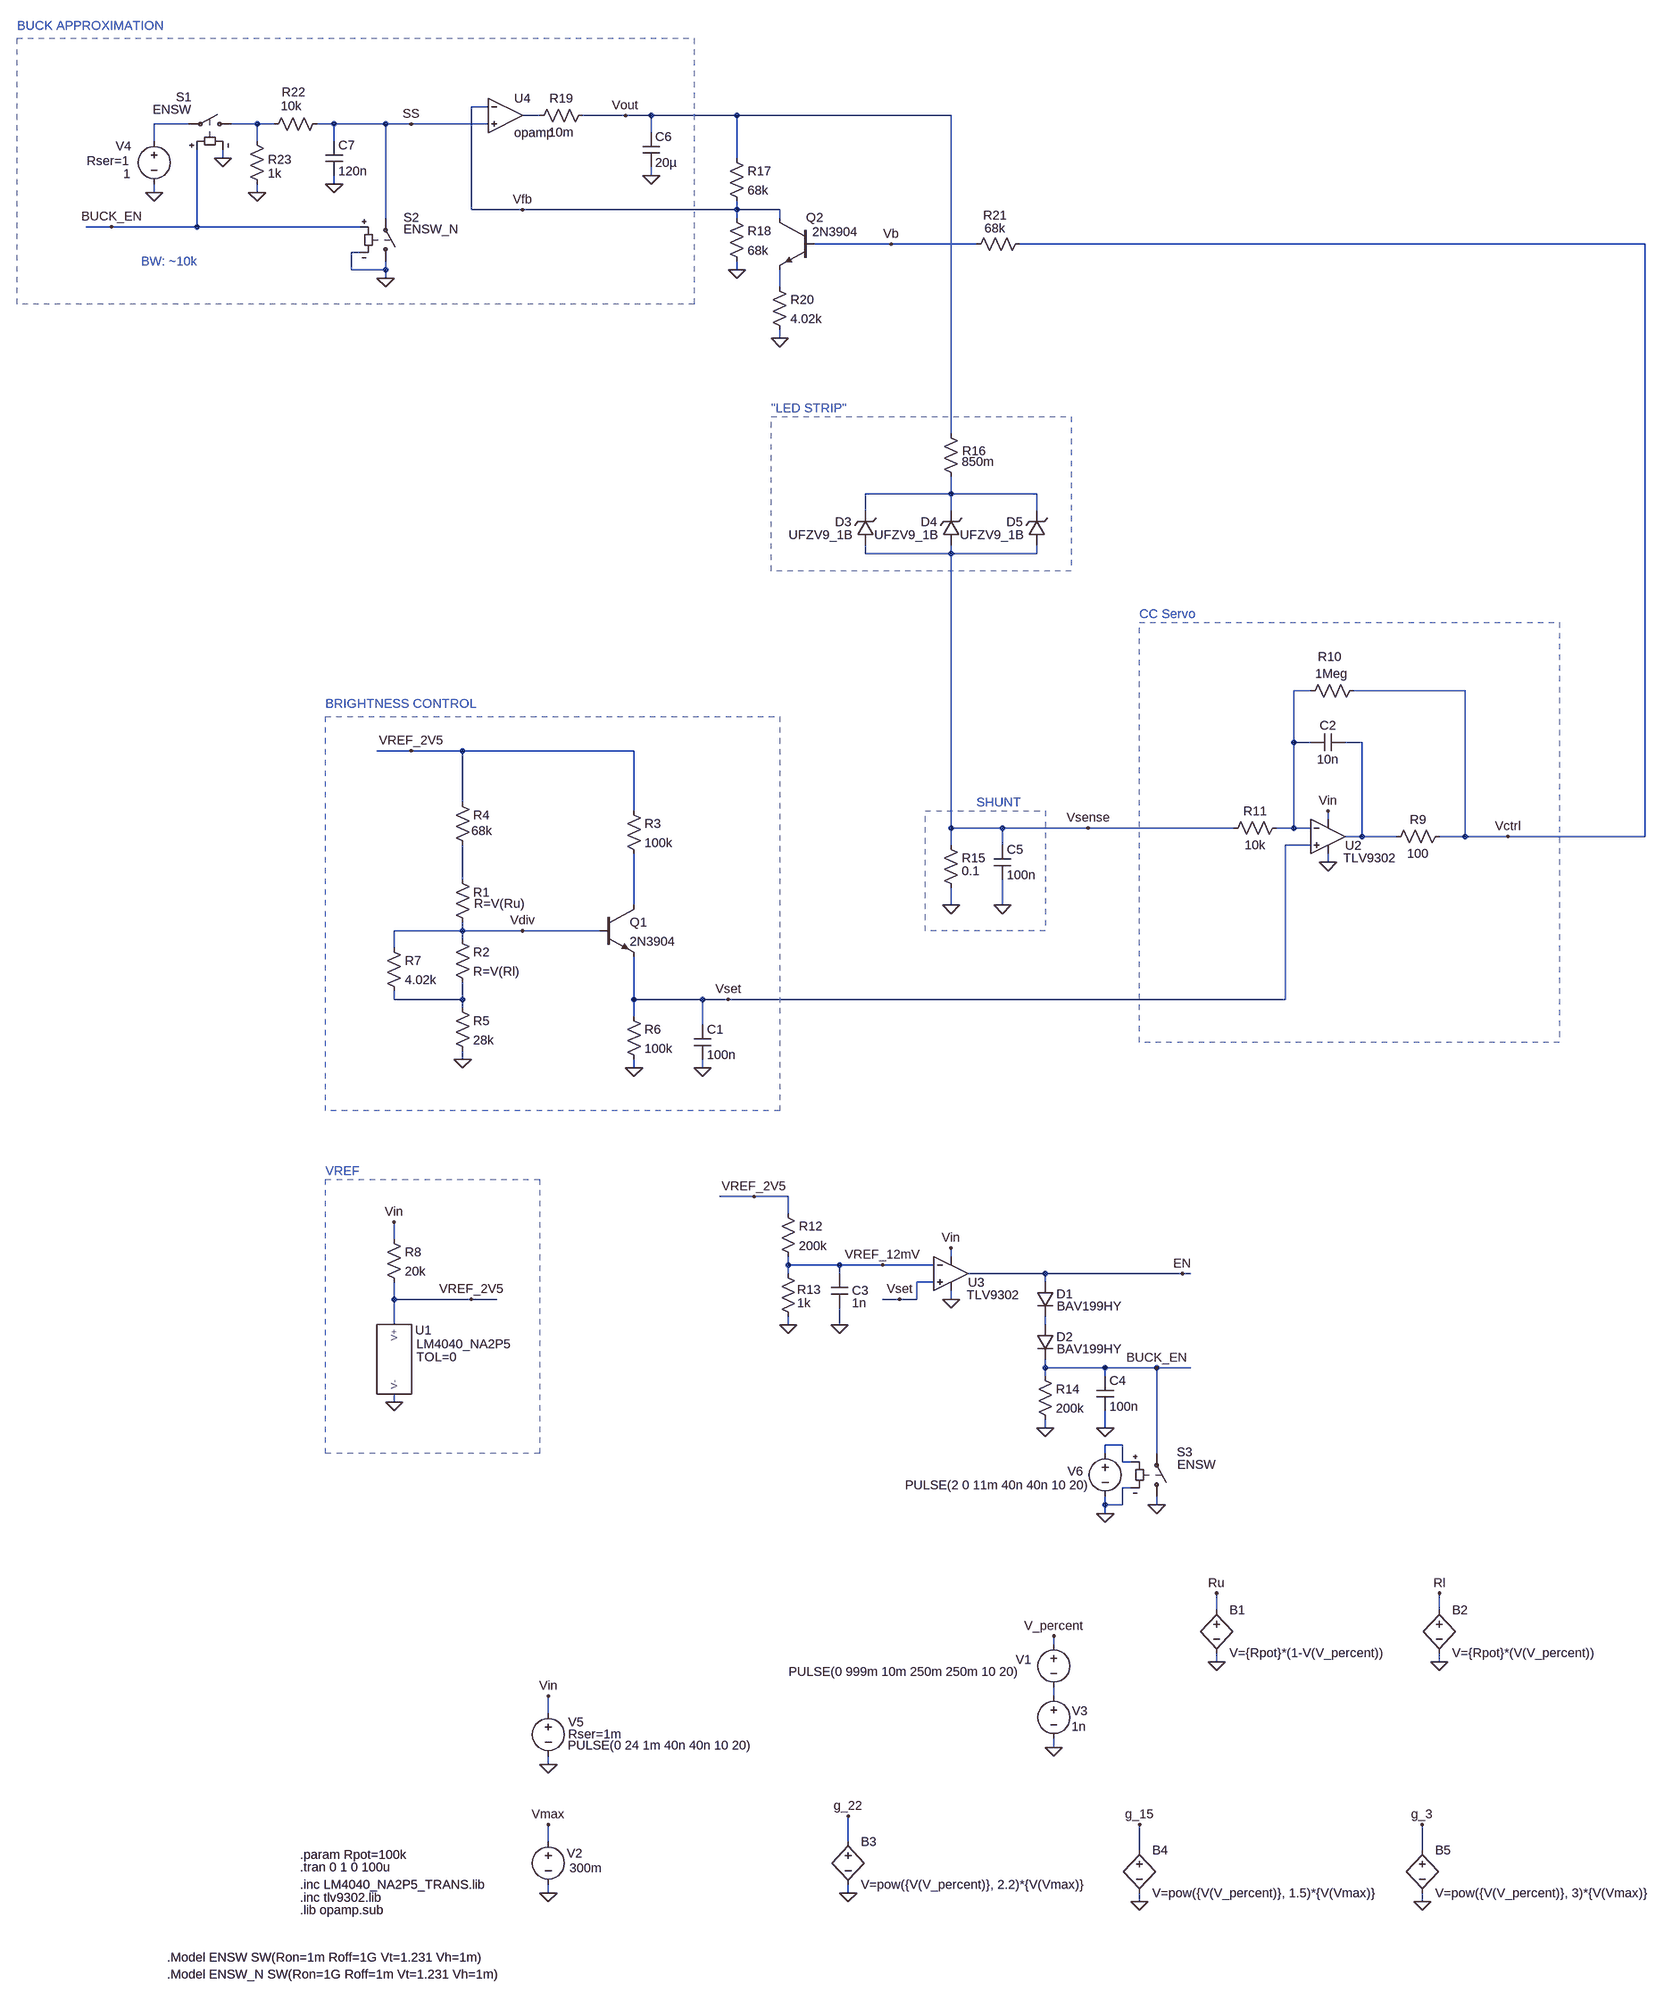
[diagram p0: schematic en2.asc]
en2.asc, the LTspice schematic file:
Version 4
SHEET 1 1748 1752
WIRE -1120 -2416 -1152 -2416
WIRE -1024 -2400 -1056 -2400
WIRE -864 -2400 -944 -2400
WIRE -816 -2400 -864 -2400
WIRE -656 -2400 -816 -2400
WIRE -256 -2400 -656 -2400
WIRE -1680 -2384 -1744 -2384
WIRE -1552 -2384 -1600 -2384
WIRE -1520 -2384 -1552 -2384
WIRE -1408 -2384 -1440 -2384
WIRE -1312 -2384 -1408 -2384
WIRE -1264 -2384 -1312 -2384
WIRE -1120 -2384 -1264 -2384
WIRE -816 -2368 -816 -2400
WIRE -1744 -2352 -1744 -2384
WIRE -1552 -2352 -1552 -2384
WIRE -1408 -2352 -1408 -2384
WIRE -1616 -2320 -1616 -2336
WIRE -656 -2320 -656 -2400
WIRE -816 -2288 -816 -2304
WIRE -1408 -2272 -1408 -2288
WIRE -1744 -2256 -1744 -2272
WIRE -1552 -2256 -1552 -2272
WIRE -1152 -2224 -1152 -2416
WIRE -1056 -2224 -1152 -2224
WIRE -656 -2224 -656 -2240
WIRE -656 -2224 -1056 -2224
WIRE -576 -2224 -656 -2224
WIRE -1312 -2208 -1312 -2384
WIRE -656 -2208 -656 -2224
WIRE -576 -2208 -576 -2224
WIRE -1824 -2192 -1872 -2192
WIRE -1664 -2192 -1664 -2336
WIRE -1664 -2192 -1824 -2192
WIRE -1360 -2192 -1664 -2192
WIRE -368 -2160 -512 -2160
WIRE -208 -2160 -368 -2160
WIRE 1040 -2160 -128 -2160
WIRE -1360 -2144 -1376 -2144
WIRE -1376 -2112 -1376 -2144
WIRE -1312 -2112 -1312 -2128
WIRE -1312 -2112 -1376 -2112
WIRE -656 -2112 -656 -2128
WIRE -1312 -2096 -1312 -2112
WIRE -576 -2080 -576 -2112
WIRE -576 -1984 -576 -2000
WIRE -256 -1504 -256 -2400
WIRE -256 -1392 -256 -1424
WIRE -256 -1392 -416 -1392
WIRE -96 -1392 -256 -1392
WIRE -416 -1360 -416 -1392
WIRE -256 -1360 -256 -1392
WIRE -96 -1360 -96 -1392
WIRE -416 -1280 -416 -1296
WIRE -256 -1280 -256 -1296
WIRE -256 -1280 -416 -1280
WIRE -96 -1280 -96 -1296
WIRE -96 -1280 -256 -1280
WIRE 416 -1024 384 -1024
WIRE 704 -1024 496 -1024
WIRE 384 -928 384 -1024
WIRE 416 -928 384 -928
WIRE 512 -928 480 -928
WIRE -1264 -912 -1328 -912
WIRE -1168 -912 -1264 -912
WIRE -848 -912 -1168 -912
WIRE -1168 -816 -1168 -912
WIRE -848 -800 -848 -912
WIRE 448 -784 448 -800
WIRE -256 -768 -256 -1280
WIRE -160 -768 -256 -768
WIRE 0 -768 -160 -768
WIRE 272 -768 0 -768
WIRE 384 -768 384 -928
WIRE 384 -768 352 -768
WIRE 416 -768 384 -768
WIRE 512 -752 512 -928
WIRE 512 -752 480 -752
WIRE 576 -752 512 -752
WIRE 704 -752 704 -1024
WIRE 704 -752 656 -752
WIRE 784 -752 704 -752
WIRE 1040 -752 1040 -2160
WIRE 1040 -752 784 -752
WIRE -256 -736 -256 -768
WIRE -160 -736 -160 -768
WIRE 416 -736 368 -736
WIRE 448 -704 448 -720
WIRE -1168 -672 -1168 -736
WIRE -848 -624 -848 -720
WIRE -256 -624 -256 -656
WIRE -160 -624 -160 -672
WIRE -1168 -576 -1168 -592
WIRE -1168 -576 -1296 -576
WIRE -1056 -576 -1168 -576
WIRE -912 -576 -1056 -576
WIRE -1168 -560 -1168 -576
WIRE -1296 -544 -1296 -576
WIRE -1296 -448 -1296 -464
WIRE -1168 -448 -1168 -480
WIRE -1168 -448 -1296 -448
WIRE -848 -448 -848 -528
WIRE -720 -448 -848 -448
WIRE -672 -448 -720 -448
WIRE 368 -448 368 -736
WIRE 368 -448 -672 -448
WIRE -1168 -432 -1168 -448
WIRE -848 -416 -848 -448
WIRE -720 -400 -720 -448
WIRE -1168 -336 -1168 -352
WIRE -848 -320 -848 -336
WIRE -720 -320 -720 -336
WIRE -624 160 -688 160
WIRE -560 160 -624 160
WIRE -560 192 -560 160
WIRE -1296 240 -1296 208
WIRE -256 272 -256 256
WIRE -560 288 -560 272
WIRE -464 288 -560 288
WIRE -384 288 -464 288
WIRE -288 288 -384 288
WIRE -560 304 -560 288
WIRE -464 304 -464 288
WIRE -80 304 -224 304
WIRE 176 304 -80 304
WIRE 192 304 176 304
WIRE -288 320 -320 320
WIRE -80 320 -80 304
WIRE -1296 352 -1296 320
WIRE -1152 352 -1296 352
WIRE -1104 352 -1152 352
WIRE -352 352 -384 352
WIRE -320 352 -320 320
WIRE -320 352 -352 352
WIRE -256 352 -256 336
WIRE -1296 400 -1296 352
WIRE -560 400 -560 384
WIRE -464 400 -464 368
WIRE -80 400 -80 384
WIRE -80 480 -80 464
WIRE 32 480 -80 480
WIRE 128 480 32 480
WIRE 192 480 128 480
WIRE -80 496 -80 480
WIRE 32 496 32 480
WIRE -1296 544 -1296 528
WIRE -80 592 -80 576
WIRE 32 592 32 560
WIRE 64 624 32 624
WIRE 32 640 32 624
WIRE 128 640 128 480
WIRE 64 656 64 624
WIRE 80 656 64 656
WIRE 80 704 64 704
WIRE 32 736 32 720
WIRE 64 736 64 704
WIRE 64 736 32 736
WIRE 128 736 128 720
WIRE 32 752 32 736
WIRE 240 1056 240 1024
WIRE 656 1056 656 1024
WIRE -64 1120 -64 1104
WIRE 240 1152 240 1136
WIRE 656 1152 656 1136
WIRE -64 1216 -64 1200
WIRE -1008 1248 -1008 1216
WIRE -64 1312 -64 1296
WIRE -1008 1344 -1008 1328
WIRE -1008 1488 -1008 1456
WIRE -448 1488 -448 1440
WIRE 96 1504 96 1456
WIRE 624 1504 624 1456
WIRE -1008 1584 -1008 1568
WIRE -448 1584 -448 1568
WIRE 96 1600 96 1584
WIRE 624 1600 624 1584
FLAG -64 1312 0
FLAG -64 1104 V_percent
FLAG 240 1152 0
FLAG 240 1024 Ru
FLAG 656 1152 0
FLAG 656 1024 Rl
FLAG -448 1584 0
FLAG -448 1440 g_22
FLAG 96 1600 0
FLAG 96 1456 g_15
FLAG 624 1600 0
FLAG 624 1456 g_3
FLAG -1008 1456 Vmax
FLAG -1008 1584 0
FLAG -1168 -336 0
FLAG -672 -448 Vset
FLAG -848 -320 0
FLAG -1056 -576 Vdiv
FLAG -1296 544 0
FLAG -1008 1344 0
FLAG -1008 1216 Vin
FLAG -1152 352 VREF_2V5
FLAG -1296 208 Vin
FLAG -720 -320 0
FLAG -1264 -912 VREF_2V5
FLAG 784 -752 Vctrl
FLAG 448 -704 0
FLAG 448 -800 Vin
FLAG -256 352 0
FLAG -256 256 Vin
FLAG -560 400 0
FLAG -464 400 0
FLAG -624 160 VREF_2V5
FLAG -352 352 Vset
FLAG -384 288 VREF_12mV
FLAG 176 304 EN
FLAG -80 592 0
FLAG 32 592 0
FLAG 128 480 BUCK_EN
FLAG -256 -624 0
FLAG -160 -624 0
FLAG 0 -768 Vsense
FLAG -1744 -2256 0
FLAG -656 -2112 0
FLAG -816 -2288 0
FLAG -864 -2400 Vout
FLAG -1056 -2224 Vfb
FLAG -576 -1984 0
FLAG -368 -2160 Vb
FLAG -1552 -2256 0
FLAG -1616 -2320 0
FLAG -1408 -2272 0
FLAG -1312 -2096 0
FLAG -1824 -2192 BUCK_EN
FLAG -1264 -2384 SS
FLAG 128 736 0
FLAG 32 752 0
SYMBOL voltage -64 1104 R0
WINDOW 0 -71 44 Left 2
WINDOW 3 -495 67 Left 2
WINDOW 123 0 0 Left 0
WINDOW 39 0 0 Left 0
SYMATTR InstName V1
SYMATTR Value PULSE(0 999m 10m 250m 250m 10 20)
SYMBOL res -1184 -688 R0
WINDOW 3 37 61 Left 2
SYMATTR Value R=V(Ru)
SYMATTR InstName R1
SYMBOL res -1184 -576 R0
SYMATTR InstName R2
SYMATTR Value R=V(Rl)
SYMBOL bv 240 1040 R0
SYMATTR InstName B1
SYMATTR Value V={Rpot}*(1-V(V_percent))
SYMBOL bv 656 1040 R0
SYMATTR InstName B2
SYMATTR Value V={Rpot}*(V(V_percent))
SYMBOL voltage -64 1200 R0
WINDOW 0 34 44 Left 2
WINDOW 3 33 73 Left 2
WINDOW 123 0 0 Left 0
WINDOW 39 0 0 Left 0
SYMATTR InstName V3
SYMATTR Value 1n
SYMBOL bv -448 1472 R0
SYMATTR InstName B3
SYMATTR Value V=pow({V(V_percent)}, 2.2)*{V(Vmax)}
SYMBOL bv 96 1488 R0
SYMATTR InstName B4
SYMATTR Value V=pow({V(V_percent)}, 1.5)*{V(Vmax)}
SYMBOL bv 624 1488 R0
SYMATTR InstName B5
SYMATTR Value V=pow({V(V_percent)}, 3)*{V(Vmax)}
SYMBOL res -1184 -832 R0
WINDOW 3 32 69 Left 2
SYMATTR Value 68k
SYMATTR InstName R4
SYMBOL voltage -1008 1472 R0
WINDOW 0 35 38 Left 2
WINDOW 3 40 65 Left 2
WINDOW 123 0 0 Left 0
WINDOW 39 0 0 Left 0
SYMATTR InstName V2
SYMATTR Value 300m
SYMBOL npn -912 -624 R0
SYMATTR InstName Q1
SYMATTR Value 2N3904
SYMBOL res -1184 -448 R0
SYMATTR InstName R5
SYMATTR Value 28k
SYMBOL res -864 -816 R0
SYMATTR InstName R3
SYMATTR Value 100k
SYMBOL res -864 -432 R0
SYMATTR InstName R6
SYMATTR Value 100k
SYMBOL res -1312 -560 R0
SYMATTR InstName R7
SYMATTR Value 4.02k
SYMBOL voltage -1008 1232 R0
WINDOW 0 37 33 Left 2
WINDOW 3 36 76 Left 2
WINDOW 123 0 0 Left 0
WINDOW 39 37 55 Left 2
SYMATTR InstName V5
SYMATTR Value PULSE(0 24 1m 40n 40n 10 20)
SYMATTR SpiceLine Rser=1m
SYMBOL res -1312 224 R0
SYMATTR InstName R8
SYMATTR Value 20k
SYMBOL LM4040_NA2P5 -1296 464 R0
WINDOW 0 55 -39 Bottom 2
SYMATTR InstName U1
SYMBOL cap -736 -400 R0
SYMATTR InstName C1
SYMATTR Value 100n
SYMBOL OpAmps\\opamp2 448 -816 R0
WINDOW 0 32 81 Left 2
WINDOW 3 29 104 Left 2
SYMATTR InstName U2
SYMATTR Value TLV9302
SYMBOL cap 480 -944 R90
WINDOW 0 0 32 VBottom 2
WINDOW 3 32 32 VTop 2
SYMATTR InstName C2
SYMATTR Value 10n
SYMBOL res 672 -768 R90
WINDOW 0 0 56 VBottom 2
WINDOW 3 32 56 VTop 2
SYMATTR InstName R9
SYMATTR Value 100
SYMBOL res 512 -1040 R90
WINDOW 0 -32 61 VBottom 2
WINDOW 3 -32 57 VTop 2
SYMATTR InstName R10
SYMATTR Value 1Meg
SYMBOL res 368 -784 R90
WINDOW 0 0 56 VBottom 2
WINDOW 3 32 56 VTop 2
SYMATTR InstName R11
SYMATTR Value 10k
SYMBOL OpAmps\\opamp2 -256 240 R0
WINDOW 0 32 81 Left 2
WINDOW 3 29 104 Left 2
SYMATTR InstName U3
SYMATTR Value TLV9302
SYMBOL res -576 176 R0
SYMATTR InstName R12
SYMATTR Value 200k
SYMBOL res -576 288 R0
WINDOW 0 33 46 Left 2
WINDOW 3 33 71 Left 2
SYMATTR InstName R13
SYMATTR Value 1k
SYMBOL cap -480 304 R0
WINDOW 0 39 32 Left 2
WINDOW 3 39 55 Left 2
SYMATTR InstName C3
SYMATTR Value 1n
SYMBOL diode -96 320 R0
WINDOW 0 37 22 Left 2
WINDOW 3 38 45 Left 2
SYMATTR InstName D1
SYMATTR Value BAV199HY
SYMBOL diode -96 400 R0
WINDOW 0 37 22 Left 2
WINDOW 3 38 45 Left 2
SYMATTR InstName D2
SYMATTR Value BAV199HY
SYMBOL res -96 480 R0
SYMATTR InstName R14
SYMATTR Value 200k
SYMBOL cap 16 496 R0
SYMATTR InstName C4
SYMATTR Value 100n
SYMBOL res -272 -752 R0
WINDOW 3 36 64 Left 2
SYMATTR Value 0.1
SYMATTR InstName R15
SYMBOL cap -176 -736 R0
SYMATTR InstName C5
SYMATTR Value 100n
SYMBOL zener -400 -1296 R180
WINDOW 0 42 43 Left 2
WINDOW 3 40 19 Left 2
SYMATTR InstName D3
SYMATTR Value UFZV9_1B
SYMATTR Description Diode
SYMATTR Type diode
SYMBOL res -272 -1520 R0
WINDOW 0 37 48 Left 2
WINDOW 3 36 68 Left 2
SYMATTR InstName R16
SYMATTR Value 850m
SYMBOL voltage -1744 -2368 R0
WINDOW 0 -72 25 Left 2
WINDOW 3 -58 77 Left 2
WINDOW 123 0 0 Left 0
WINDOW 39 -126 53 Left 2
SYMATTR InstName V4
SYMATTR Value 1
SYMATTR SpiceLine Rser=1
SYMBOL res -672 -2336 R0
SYMATTR InstName R17
SYMATTR Value 68k
SYMBOL res -672 -2224 R0
SYMATTR InstName R18
SYMATTR Value 68k
SYMBOL res -928 -2416 R90
WINDOW 0 0 56 VBottom 2
WINDOW 3 32 56 VTop 2
SYMATTR InstName R19
SYMATTR Value 10m
SYMBOL cap -832 -2368 R0
SYMATTR InstName C6
SYMATTR Value 20µ
SYMBOL zener -240 -1296 R180
WINDOW 0 42 43 Left 2
WINDOW 3 40 19 Left 2
SYMATTR InstName D4
SYMATTR Value UFZV9_1B
SYMATTR Description Diode
SYMATTR Type diode
SYMBOL zener -80 -1296 R180
WINDOW 0 42 43 Left 2
WINDOW 3 40 19 Left 2
SYMATTR InstName D5
SYMATTR Value UFZV9_1B
SYMATTR Description Diode
SYMATTR Type diode
SYMBOL npn -512 -2208 M0
WINDOW 0 -18 -1 Left 2
WINDOW 3 -82 25 Left 2
SYMATTR InstName Q2
SYMATTR Value 2N3904
SYMBOL res -592 -2096 R0
SYMATTR InstName R20
SYMATTR Value 4.02k
SYMBOL res -112 -2176 R90
WINDOW 0 -22 62 VBottom 2
WINDOW 3 -29 62 VTop 2
SYMATTR InstName R21
SYMATTR Value 68k
SYMBOL sw -1584 -2384 M270
WINDOW 0 50 90 VRight 2
WINDOW 3 27 91 VRight 2
SYMATTR InstName S1
SYMATTR Value ENSW
SYMBOL res -1424 -2400 R90
WINDOW 0 -28 60 VBottom 2
WINDOW 3 -33 64 VTop 2
SYMATTR InstName R22
SYMATTR Value 10k
SYMBOL cap -1424 -2352 R0
SYMATTR InstName C7
SYMATTR Value 120n
SYMBOL sw -1312 -2112 M180
WINDOW 0 34 97 Left 2
WINDOW 3 34 76 Left 2
SYMATTR InstName S2
SYMATTR Value ENSW_N
SYMBOL res -1568 -2368 R0
WINDOW 0 36 50 Left 2
SYMATTR InstName R23
SYMATTR Value 1k
SYMBOL sw 128 736 M180
WINDOW 0 38 99 Left 2
WINDOW 3 39 75 Left 2
SYMATTR InstName S3
SYMATTR Value ENSW
SYMBOL voltage 32 624 R0
WINDOW 0 -70 49 Left 2
WINDOW 3 -374 75 Left 2
WINDOW 123 0 0 Left 0
WINDOW 39 0 0 Left 0
SYMATTR InstName V6
SYMATTR Value PULSE(2 0 11m 40n 40n 10 20)
SYMBOL OpAmps\\opamp -1088 -2464 R0
SYMATTR InstName U4
SYMATTR SpiceLine2 GBW=10k
TEXT -1472 1512 Left 2 !.param Rpot=100k
TEXT -1472 1536 Left 2 !.tran 0 1 0 100u
TEXT -1472 1568 Left 2 !.inc LM4040_NA2P5_TRANS.lib
TEXT -1424 112 Left 2 ;VREF
TEXT -1424 -1000 Left 2 ;BRIGHTNESS CONTROL
TEXT -1472 1592 Left 2 !.inc tlv9302.lib
TEXT -1472 1616 Left 2 !.lib opamp.sub
TEXT 96 -1168 Left 2 ;CC Servo
TEXT -208 -816 Left 2 ;SHUNT
TEXT -2000 -2568 Left 2 ;BUCK APPROXIMATION
TEXT -592 -1552 Left 2 ;"LED STRIP"
TEXT -1768 -2128 Left 2 ;BW: ~10k
TEXT -1720 1704 Left 2 !.Model ENSW SW(Ron=1m Roff=1G Vt=1.231 Vh=1m)
TEXT -1720 1736 Left 2 !.Model ENSW_N SW(Ron=1G Roff=1m Vt=1.231 Vh=1m)
RECTANGLE Normal -1024 640 -1424 128 2
RECTANGLE Normal -576 -240 -1424 -976 2
RECTANGLE Normal 880 -368 96 -1152 2
RECTANGLE Normal -80 -576 -304 -800 2
RECTANGLE Normal -32 -1248 -592 -1536 2
RECTANGLE Normal -736 -2048 -2000 -2544 2

The netlist it stands for:
* en2.asc
V1 V_percent N013 PULSE(0 999m 10m 250m 250m 10 20)
R1 N008 Vdiv R=V(Ru)
R2 Vdiv N010 R=V(Rl)
B1 Ru 0 V={Rpot}*(1-V(V_percent))
B2 Rl 0 V={Rpot}*(V(V_percent))
V3 N013 0 1n
B3 g_22 0 V=pow({V(V_percent)}, 2.2)*{V(Vmax)}
B4 g_15 0 V=pow({V(V_percent)}, 1.5)*{V(Vmax)}
B5 g_3 0 V=pow({V(V_percent)}, 3)*{V(Vmax)}
R4 VREF_2V5 N008 68k
V2 Vmax 0 300m
Q1 N009 Vdiv Vset 0 2N3904
R5 N010 0 28k
R3 VREF_2V5 N009 100k
R6 Vset 0 100k
R7 Vdiv N010 4.02k
V5 Vin 0 PULSE(0 24 1m 40n 40n 10 20) Rser=1m
R8 Vin VREF_2V5 20k
XU1 VREF_2V5 0 LM4040_NA2P5 TOL=0  ; pins V+ V-
C1 Vset 0 100n
XU2 Vset N006 Vin 0 N007 TLV9302  ; pins In+ In- V+ V- OUT
C2 N007 N006 10n
R9 Vctrl N007 100
R10 Vctrl N006 1Meg
R11 N006 Vsense 10k
XU3 Vset VREF_12mV Vin 0 EN TLV9302  ; pins In+ In- V+ V- OUT
R12 VREF_2V5 VREF_12mV 200k
R13 VREF_12mV 0 1k
C3 VREF_12mV 0 1n
D1 EN N011 BAV199HY
D2 N011 BUCK_EN BAV199HY
R14 BUCK_EN 0 200k
C4 BUCK_EN 0 100n
R15 Vsense 0 0.1
C5 Vsense 0 100n
D3 Vsense N005 UFZV9_1B
R16 Vout N005 850m
V4 N002 0 1 Rser=1
R17 Vout Vfb 68k
R18 Vfb 0 68k
R19 Vout N001 10m
C6 Vout 0 20µ
D4 Vsense N005 UFZV9_1B
D5 Vsense N005 UFZV9_1B
Q2 Vfb Vb N004 0 2N3904
R20 N004 0 4.02k
R21 Vctrl Vb 68k
S1 N003 N002 BUCK_EN 0 ENSW
R22 SS N003 10k
C7 SS 0 120n
S2 0 SS BUCK_EN 0 ENSW_N
R23 N003 0 1k
S3 0 BUCK_EN N012 0 ENSW
V6 N012 0 PULSE(2 0 11m 40n 40n 10 20)
XU4 Vfb SS N001 opamp Aol=100K GBW=10k  ; pins invin noninvin out
.model D D
.lib standard.dio
.model NPN NPN
.model PNP PNP
.lib standard.bjt
.param Rpot=100k
.tran 0 1 0 100u
.inc LM4040_NA2P5_TRANS.lib
* VREF
* BRIGHTNESS CONTROL
.inc tlv9302.lib
.lib opamp.sub
* CC Servo
* SHUNT
* BUCK APPROXIMATION
* "LED STRIP"
* BW: ~10k
.Model ENSW SW(Ron=1m Roff=1G Vt=1.231 Vh=1m)
.Model ENSW_N SW(Ron=1G Roff=1m Vt=1.231 Vh=1m)
.lib D:\Users\seth\Documents\Git\cc-led-driver\ltspice\LM4040_NA2P5_TRANS.lib
.backanno
.end